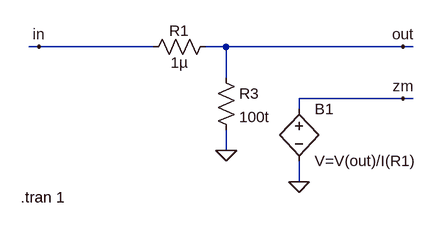
[diagram p0: schematic Draft1.asc]
Draft1.asc, the LTspice schematic file:
Version 4
SHEET 1 880 680
WIRE -80 176 -96 176
WIRE 96 176 -80 176
WIRE 208 176 176 176
WIRE 480 176 208 176
WIRE 496 176 480 176
WIRE 208 224 208 176
WIRE 480 256 320 256
WIRE 496 256 480 256
WIRE 320 272 320 256
WIRE 208 336 208 304
WIRE 320 384 320 352
FLAG -80 176 in
FLAG 480 176 out
FLAG 320 384 0
FLAG 480 256 zm
FLAG 208 336 0
SYMBOL bv 320 256 R0
SYMATTR InstName B1
SYMATTR Value V=V(out)/I(R1)
SYMBOL res 80 192 R270
WINDOW 0 25 56 VTop 2
WINDOW 3 7 56 VBottom 2
SYMATTR InstName R1
SYMATTR Value 1µ
SYMBOL res 192 208 R0
SYMATTR InstName R3
SYMATTR Value 100t
TEXT -108 408 Left 2 !.tran 1

The netlist it stands for:
* Draft1.asc
B1 zm 0 V=V(out)/I(R1)
R1 in out 1µ
R3 out 0 100t
.tran 1
.backanno
.end